# EAGLE design I2C-LTS-LC (EAGLE 6.5.0)
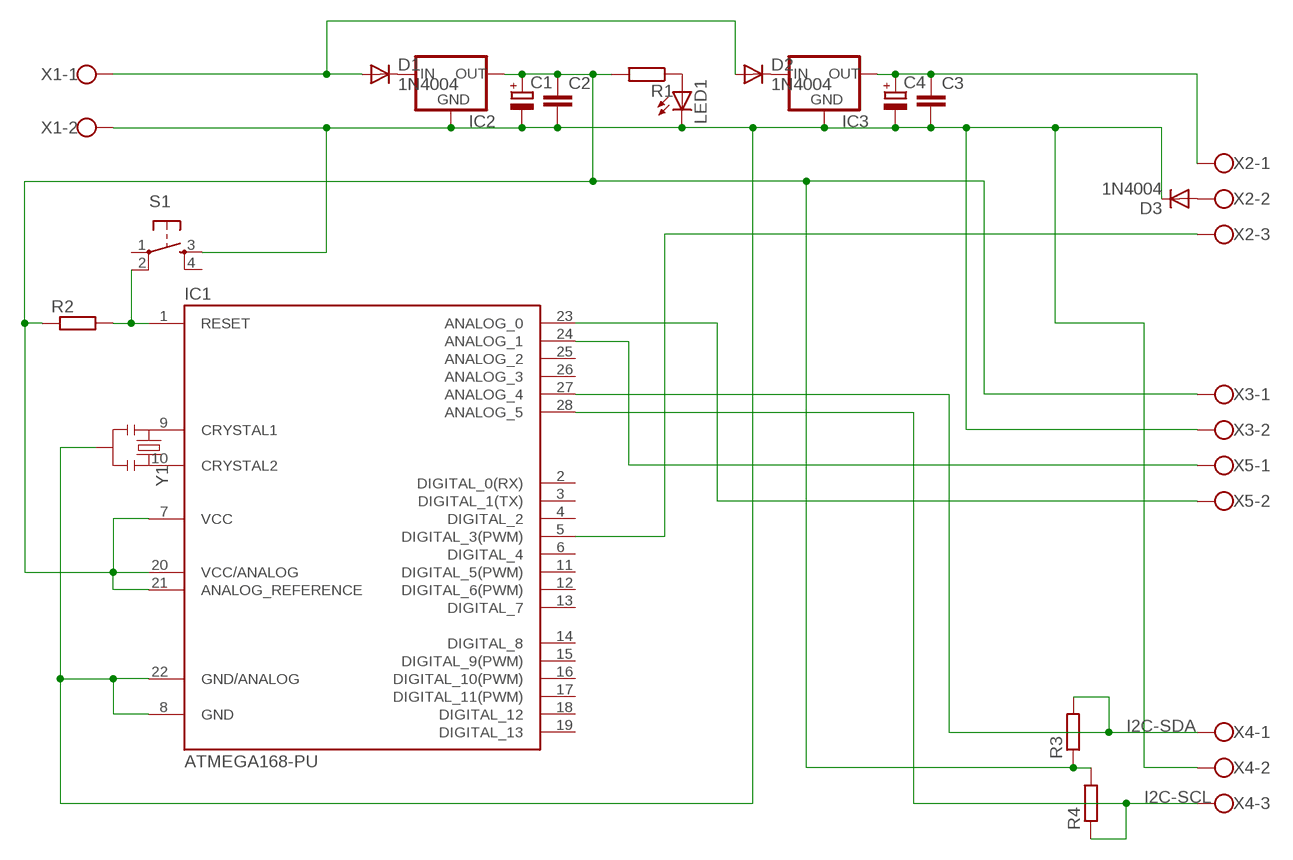
[diagram p0: schematic, sheet 1]

## Parts
C1  CPOL-EUE5-10.5  [E5-10,5]
C2  C-EU050-024X044  [C050-024X044]
C3  C-EU050-024X044  [C050-024X044]
C4  CPOL-EUE5-10.5  [E5-10,5]
D1  1N4004  [DO41-10]
D2  1N4004  [DO41-10]
D3  1N4004  [DO41-10]
IC1  ATMEGA168-PU  [DIL28-3]
IC2  78XXL  [78XXL]
IC3  78XXL  [78XXL]
LED1  LED3MM  [LED3MM]
R1  R-EU_0207/12  [0207/12]
R2  R-EU_0207/12  [0207/12]
R3  R-EU_0207/12  [0207/12]
R4  R-EU_0207/12  [0207/12]
S1  TAC_SWITCHPTH  [TACTILE-PTH]
X1  W237-102  [W237-102]
X2  W237-103  [W237-103]
X3  W237-102  [W237-102]
X4  W237-103  [W237-103]
X5  W237-102  [W237-102]
Y1  RESONATORPTH  [RESONATOR-PTH]

## Nets
I2C-SCL [Signal]: IC1.28(ANALOG_5) R4.1 X4.3
I2C-SDA [Signal]: IC1.27(ANALOG_4) R3.2 X4.1
N$1 [Signal]: IC1.10(CRYSTAL2) Y1.3
N$2 [Signal]: IC1.9(CRYSTAL1) Y1.1
N$3 [Signal]: LED1.A R1.1
N$4: D1.C IC2.IN
N$5: D2.C IC3.IN
N$6: D3.A X2.2
N$7 [Signal]: IC1.5(DIGITAL_3(PWM)) X2.3
N$8 [Signal]: C1.- C2.2 C3.2 C4.- D3.C IC1.8(GND) IC1.22(GND/ANALOG) IC2.GND IC3.GND LED1.K(C) S1.3 X1.2 X3.2 X4.2 Y1.2
N$9 [Signal]: IC1.23(ANALOG_0) X5.2
N$10 [Signal]: IC1.24(ANALOG_1) X5.1
N$11: C3.1 C4.+ IC3.OUT X2.1
N$13 [Signal]: C1.+ C2.1 IC1.7(VCC) IC1.20(VCC/ANALOG) IC1.21(ANALOG_REFERENCE) IC2.OUT R1.2 R2.1 R3.1 R4.2 X3.1
N$14: D1.A D2.A X1.1
N$17 [Signal]: IC1.1(RESET) R2.2 S1.2
Unconnected: IC1.2(DIGITAL_0(RX)) IC1.3(DIGITAL_1(TX)) IC1.4(DIGITAL_2) IC1.6(DIGITAL_4) IC1.11(DIGITAL_5(PWM)) IC1.12(DIGITAL_6(PWM)) IC1.13(DIGITAL_7) IC1.14(DIGITAL_8) IC1.15(DIGITAL_9(PWM)) IC1.16(DIGITAL_10(PWM)) IC1.17(DIGITAL_11(PWM)) IC1.18(DIGITAL_12) IC1.19(DIGITAL_13) IC1.25(ANALOG_2) IC1.26(ANALOG_3) S1.1 S1.4

## Library data of the parts
C1 C4 = resistor:CPOL-EU: POLARIZED CAPACITOR, European symbol
C2 C3 = resistor:C-EU: CAPACITOR, European symbol
D1-D3 = diode:1N4004: DIODE general purpose rectifier, 1 A
IC1 = Arduino-AVR:ATMEGA168-PU
IC2 IC3 = v-reg:78XXL: VOLTAGE REGULATOR
LED1 = led:LED: LED OSRAM: - CHIPLED LG R971, LG N971, LY N971, LG Q971, LY Q971, LO R971, LY R971 LH N974, LH R974 LS Q976, LO Q976, LY Q976 LO Q996 - Hyper CHIPLED LW Q18S LB Q993, LB Q99A, LB R99A - SideLED LS A670, LO A670, LY A670, LG A670, LP A670 LB A673, LV A673, LT A673, LW A673 LH A674 LY A675 LS A676, LA A676, LO A676, LY A676, LW A676 LS A679, LY A679, LG A679 - Hyper Micro SIDELED® LS Y876, LA Y876, LO Y876, LY Y876 LT Y87S - SmartLED LW L88C, LW L88S LB L89C, LB L89S, LG L890 LS L89K, LO L89K, LY L89K LS L896, LA L896, LO L896, LY L896 - TOPLED LS T670, LO T670, LY T670, LG T670, LP T670 LSG T670, LSP T670, LSY T670, LOP T670, LYG T670 LG T671, LOG T671, LSG T671 LB T673, LV T673, LT T673, LW T673 LH T674 LS T676, LA T676, LO T676, LY T676, LB T676, LH T676, LSB T676, LW T676 LB T67C, LV T67C, LT T67C, LS T67K, LO T67K, LY T67K, LW E67C LS E67B, LA E67B, LO E67B, LY E67B, LB E67C, LV E67C, LT E67C LW T67C LS T679, LY T679, LG T679 LS T770, LO T770, LY T770, LG T770, LP T770 LB T773, LV T773, LT T773, LW T773 LH T774 LS E675, LA E675, LY E675, LS T675 LS T776, LA T776, LO T776, LY T776, LB T776 LHGB T686 LT T68C, LB T68C - Hyper Mini TOPLED® LB M676 - Mini TOPLED Santana® LG M470 LS M47K, LO M47K, LY M47K Source: http://www.osram.convergy.de LUXEON: - LUMILED® LXK2-PW12-R00, LXK2-PW12-S00, LXK2-PW14-U00, LXK2-PW14-V00 LXK2-PM12-R00, LXK2-PM12-S00, LXK2-PM14-U00 LXK2-PE12-Q00, LXK2-PE12-R00, LXK2-PE12-S00, LXK2-PE14-T00, LXK2-PE14-U00 LXK2-PB12-K00, LXK2-PB12-L00, LXK2-PB12-M00, LXK2-PB14-N00, LXK2-PB14-P00, LXK2-PB14-Q00 LXK2-PR12-L00, LXK2-PR12-M00, LXK2-PR14-Q00, LXK2-PR14-R00 LXK2-PD12-Q00, LXK2-PD12-R00, LXK2-PD12-S00 LXK2-PH12-R00, LXK2-PH12-S00 LXK2-PL12-P00, LXK2-PL12-Q00, LXK2-PL12-R00 Source: www.luxeon.com KINGBRIGHT: KA-3528ASYC Source: www.kingbright.com
R1-R4 = resistor:R-EU_: RESISTOR, European symbol
S1 = SparkFun-Electromechanical:TAC_SWITCH: Momentary Switch Button commonly used for reset or general input. Spark Fun Electronics SKU : COM-00097 SMT- SWCH-08247
X1 X3 X5 = con-wago-500:W237-102: WAGO SCREW CLAMP; MPN: 237-102; OC_FARNELL: unknown; OC_NEWARK: 70K9898
X2 X4 = con-wago-500:W237-103: WAGO SCREW CLAMP; MPN: 237-103; OC_FARNELL: unknown; OC_NEWARK: 18M7116
Y1 = SparkFun-FreqCtrl:RESONATOR: Resonator Small SMD resonator. Used, eg, on the Arduino Pro/ Pro Mini boards. 8MHz- XTAL-08895 16MHz- XTAL-08900

## Net classes
0 Power: width 1.5 mm, drill 0.5 mm, clearance 1 mm
1 Signal: width 0.75 mm, drill 0.5 mm, clearance 0.5 mm
2 Tiny signal: width 0.406 mm

## Board
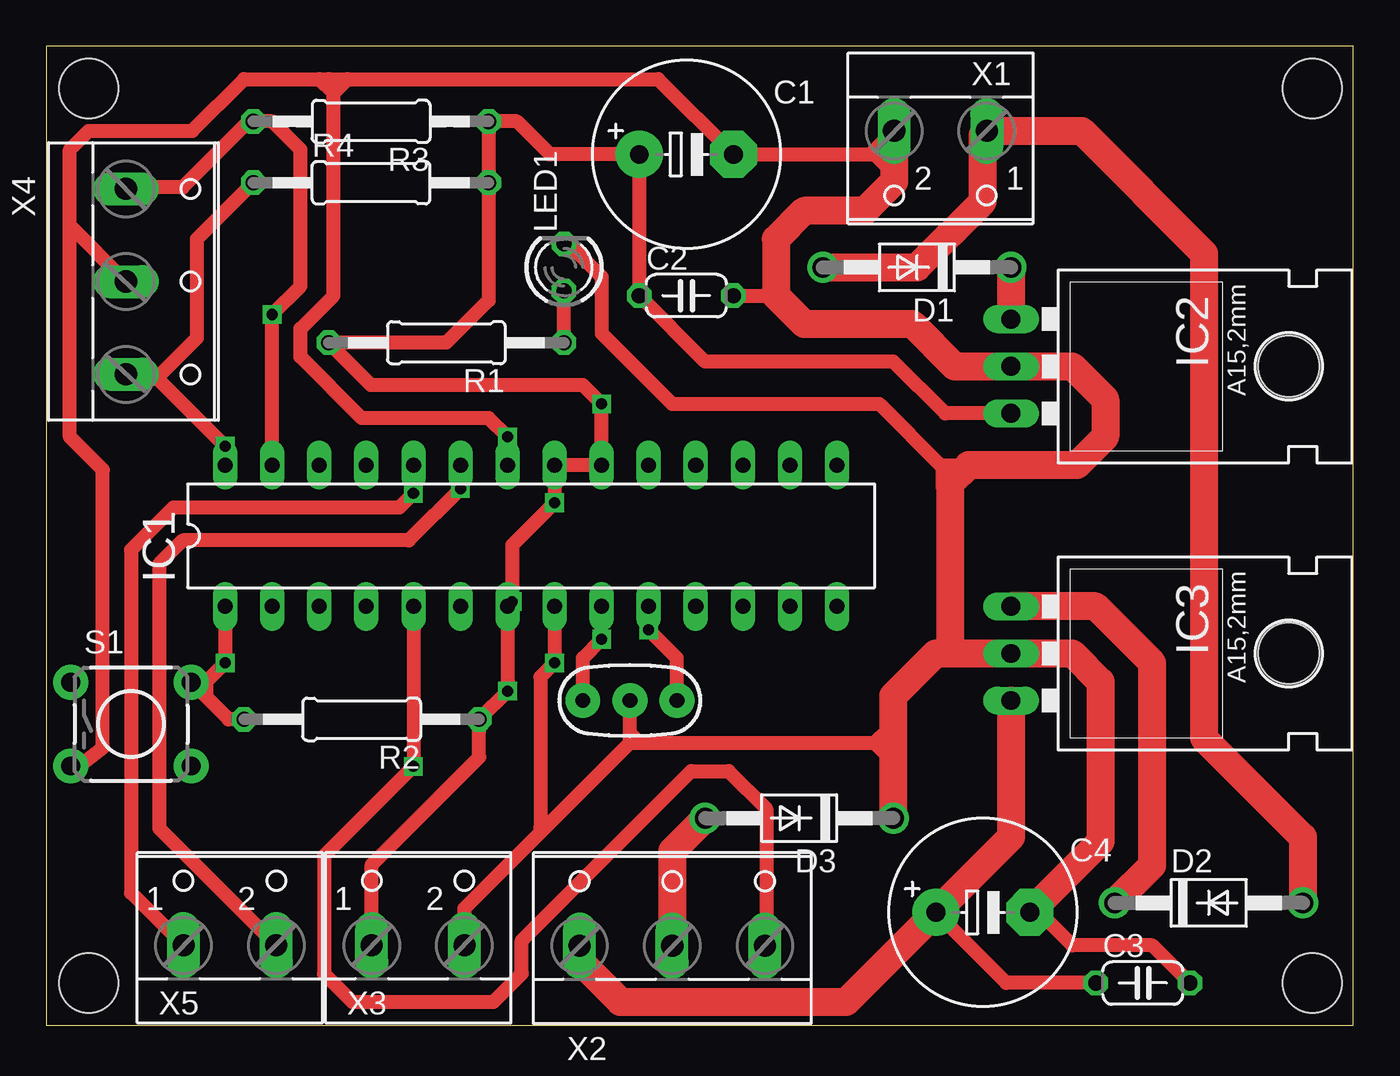
[diagram p1: board, top side]
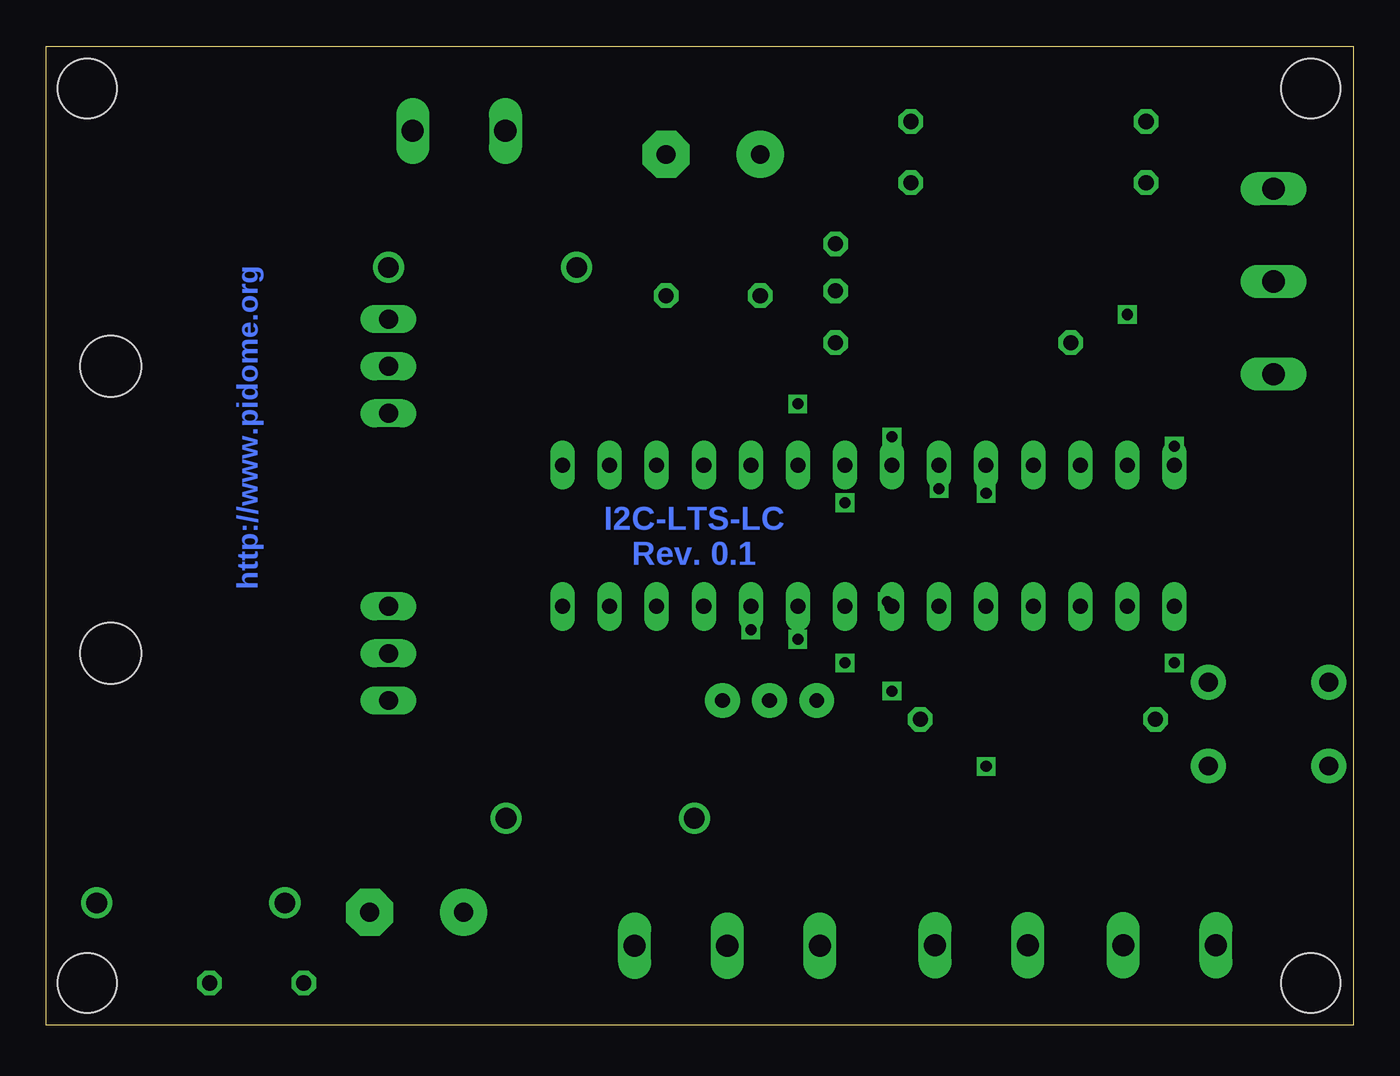
[diagram p2: board, bottom side, seen from below]

Size 70.54 x 52.82 mm. Coordinates in mm from the lower left corner, seen from the top.
Outline: 0,0 70.54,0 70.54,52.82 0,52.82 0,0
Copper layers (1*16): Top 0.035mm / dielectric 1.5mm / Bottom 0.035mm
Design rules "default": minimum track width 10mil, minimum drill 24mil, track to track 8mil, track to pad 8mil, pad to pad 8mil, via to via 8mil, smd to smd 8mil, copper to edge 40mil, drill to drill 8mil, minimum pad ring 10mil, minimum via ring 8mil, stop-mask expansion 4mil, vias tented up to drill 0mil, thermal gap 10mil
Holes 3.2 mm at 2.29,2.29 68.33,2.29 2.29,50.55 68.33,50.55

### Footprints (pad centres in the part's own frame; a part is rotated, then mirrored left to right if it is on the bottom)
E5-10,5 = drill 1.016 pad 2.54: + -2.54,0 | drill 1.016 pad 2.54 octagon: - 2.54,0
C050-024X044 = drill 0.813 octagon: 1 -2.54,0; 2 2.54,0
DO41-10 = drill 1.118: A 5.08,0; C -5.08,0
DIL28-3 = drill 0.813 long: 1 -16.51,-3.81; 2 -13.97,-3.81; 3 -11.43,-3.81; 4 -8.89,-3.81; 5 -6.35,-3.81; 6 -3.81,-3.81; 7 -1.27,-3.81; 8 1.27,-3.81; 9 3.81,-3.81; 10 6.35,-3.81; 11 8.89,-3.81; 12 11.43,-3.81; 13 13.97,-3.81; 14 16.51,-3.81; 15 16.51,3.81; 16 13.97,3.81; 17 11.43,3.81; 18 8.89,3.81; 19 6.35,3.81; 20 3.81,3.81; 21 1.27,3.81; 22 -1.27,3.81; 23 -3.81,3.81; 24 -6.35,3.81; 25 -8.89,3.81; 26 -11.43,3.81; 27 -13.97,3.81; 28 -16.51,3.81
78XXL = drill 1.016 long: GND 0,-3.81; IN -2.54,-3.81; OUT 2.54,-3.81 | hole 3.302: 0,11.176
LED3MM = drill 0.813 octagon: A -1.27,0; K 1.27,0
0207/12 = drill 0.813 octagon: 1 -6.35,0; 2 6.35,0
TACTILE-PTH = drill 1.016 pad 1.88: 1 -3.251,2.261; 2 3.251,2.261; 3 -3.251,-2.261; 4 3.251,-2.261
W237-102 = drill 1.194 long: 1 -2.5,-1.27; 2 2.5,-1.27
W237-103 = drill 1.194 long: 1 -5,-1.29; 2 0,-1.29; 3 5,-1.29
RESONATOR-PTH = drill 0.8 pad 1.88: 1 -2.54,0; 2 0,0; 3 2.54,0

### Placement (x,y rotation side)
C1  34.54,46.99 0 top
C2  34.54,39.37 0 top
C3  59.18,2.29 0 top
C4  50.55,6.1 0 top
D1  46.99,40.89 180 top
D2  62.74,6.6 0 top
D3  40.64,11.18 180 top
IC1  26.16,26.42 0 top
IC2  55.88,35.56 270 top
IC3  55.88,20.07 270 top
LED1  27.94,40.89 90 top
R1  21.59,36.83 180 top
R2  17.02,16.51 180 top
R3  17.53,48.77 180 top
R4  17.53,45.47 0 top
S1  4.57,16.26 0 top
X1  48.26,46.99 180 top
X2  33.78,5.59 0 top
X3  20.07,5.59 0 top
X4  5.59,40.13 270 top
X5  9.91,5.59 0 top
Y1  31.5,17.53 0 top

### Tracks (layer width: path | path; a pad name or v marks a point on that pad's centre or on a via)
I2C-SCL  (via drill 0.6)
  Top 0.75: R4.1 8.13,42.42 8.13,37.08 6.1,35.05 5.84,35.05 | 5.84,35.05 4.38,35.05 X4.3 | IC1.28 v9.65,31.24 5.84,35.05
I2C-SDA  (via drill 0.6)
  Top 0.75: X4.1 4.38,45.21 7.37,45.21 10.92,48.77 R3.2 12.19,48.77 13.72,47.24 13.72,39.88 v12.19,38.35 IC1.27
N$1  (via drill 0.6)
  Top 0.75: Y1.3 34.04,19.81 v32.51,21.34 IC1.10
N$2  (via drill 0.6)
  Top 0.75: Y1.1 28.96,19.81 v29.97,20.83 IC1.9
N$3
  Top 0.75: R1.1 LED1.A
N$4
  Top 1.5: D1.C IC2.IN
N$5
  Top 1.5: D2.C 59.69,8.64 59.69,19.56 56.64,22.61 IC3.IN
N$6
  Top 1.5: D3.A 33.78,9.4 X2.2
N$7  (via drill 0.6)
  Top 0.75: IC1.5 v19.81,13.97 14.99,9.14 14.99,2.79 16.51,1.27 24.13,1.27 25.65,2.79 25.65,4.57 34.8,13.72 36.83,13.72 38.86,11.68 38.86,4.38 X2.3
N$8  (via drill 0.6)
  Top 0.75: C3.2 59.69,4.32 55.37,4.32 53.59,6.1 C4.- | X1.2 44.49,46.99 C1.- 33.02,51.05 16.26,51.05 | C2.2 39.12,39.37 39.37,39.62 | X4.2 1.27,43.16 | 1.27,43.16 1.27,47.24 2.29,48.26 7.87,48.26 10.67,51.05 14.73,51.05 | 14.73,51.05 15.24,51.05 | 15.24,51.05 16.26,51.05 | X3.2 22.57,6.31 26.67,10.41 | 26.67,10.41 26.92,10.67 | 31.5,15.24 31.5,15.75 | 31.5,15.75 Y1.2 | 26.67,10.67 26.67,10.41 | S1.3 1.8,13.99 3.05,14.99 3.05,29.97 1.27,31.75 1.27,43.16 | LED1.K 28.19,42.16 29.97,40.39 29.97,37.34 33.78,33.53 44.96,33.53 48.26,30.23 | 48.26,30.23 48.77,29.72 48.77,29.21 48.77,20.32 49.02,20.07 | IC1.8 v27.43,19.56 26.67,18.8 26.67,10.67 | 26.67,10.67 26.92,10.67 | 26.92,10.67 31.5,15.24 | 31.5,15.24 32,15.24 | 32,15.24 44.7,15.24 | 44.7,15.24 45.47,15.24 45.72,14.99 | 45.47,14.48 44.7,15.24 | 44.7,15.24 45.47,16 | 31.5,15.75 32,15.24 | 48.26,30.23 49.53,30.23 49.78,29.97 | IC1.22 v24.89,31.75 23.88,32.77 17.02,32.77 13.72,36.07 13.72,37.59 15.49,39.37 15.49,50.29 | 15.49,50.29 15.49,50.8 15.24,51.05 | 16.26,51.05 15.49,50.29 | 15.49,50.29 14.73,51.05
  Top 1.5: C4.- 56.9,9.91 56.9,18.54 55.37,20.07 IC3.GND 49.02,20.07 48.77,20.07 | X1.2 45.76,45.51 44.2,43.94 40.89,43.94 39.37,42.42 39.37,39.62 39.37,39.37 40.89,37.85 46.74,37.85 49.02,35.56 IC2.GND 55.37,35.56 57.15,33.78 57.15,31.75 55.63,30.23 49.78,30.23 48.77,29.21 48.77,20.07 | D3.C 45.72,14.99 45.72,17.78 48.01,20.07 48.77,20.07
N$9  (via drill 0.6)
  Top 0.75: IC1.23 v22.35,28.96 19.56,26.16 7.37,26.16 6.1,24.89 6.1,10.63 X5.2
N$10  (via drill 0.6)
  Top 0.75: IC1.24 v19.81,28.7 19.05,27.94 6.86,27.94 4.57,25.65 4.57,7.15 X5.1
N$11
  Top 0.75: C3.1 51.82,2.29 C4.+
  Top 1.5: IC3.OUT 52.07,10.16 C4.+ 43.18,1.27 30.99,1.27 28.78,3.48 X2.1
N$12
  Top 0.75: 48.39,29.06 48.39,29.97 48.56,30.15
N$13  (via drill 0.6)
  Top 0.75: IC2.OUT 48.51,33.02 45.72,35.81 35.56,35.81 C2.1 C1.+ 27.18,46.99 25.4,48.77 R3.1 R4.2 23.88,39.12 21.59,36.83 R1.2 17.53,34.54 28.96,34.54 v29.97,33.53 IC1.20 IC1.21 v27.43,28.19 25.15,25.91 v25.15,22.86 IC1.7 v24.89,18.03 R2.1 23.37,14.48 17.57,8.68 X3.1
N$14
  Top 1.5: D2.A 67.82,10.16 62.48,15.49 62.48,41.66 55.88,48.26 X1.1 50.55,48.05 50.55,44.45 46.99,40.89 D1.A
N$15
  Top 0.75: 44.7,46.99 45.47,46.23
N$17  (via drill 0.6)
  Top 0.75: R2.2 9.83,16.51 8.22,18.12 | 8.22,18.12 S1.2 | IC1.1 v9.65,19.56 8.64,18.54 | 8.64,18.54 8.22,18.12 | 8.64,18.54 8.64,17.78

### Text on the board
Bottom: http://www.pidome.org | I2C-LTS-LC / Rev. 0.1